# Altium project Boost-Shield.PrjPcb
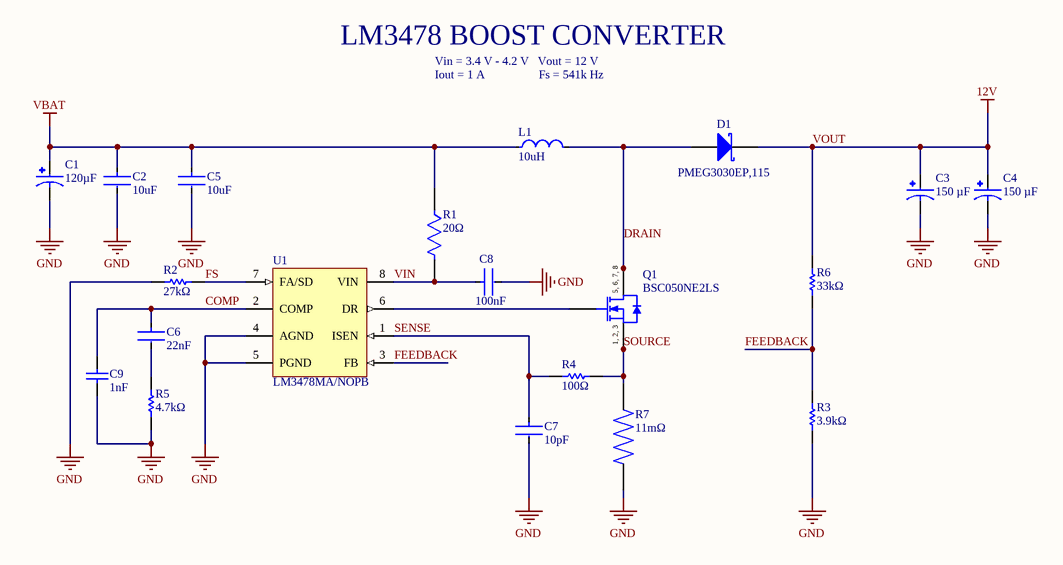
[diagram p0: Boost-Shield-V1.SchDoc]
Designer: Denil Poudel; Revision: 1
3 sheets, 74 parts. Net scope: global (net labels, ports and power ports of the same name join across sheets).
Board files: Boost-Shield-V1.PcbDoc, Boost-Shield-V2.PcbDoc, Boost-Shield-V1.5.PcbDoc
Sheets:
  Boost-Shield-V1.SchDoc
  Boost-Shield-V2.SchDoc
  Boost-Shield-V1.5.SchDoc

## Sheet Boost-Shield-V1.SchDoc
size A; SheetNumber: 1; SheetTotal: 3

### Parts
C1  120µF  [CAP_EEFCX0J121R]
C2  10uF  [FP-C0805C-DG-MFG]
C3  150 µF  [CAP_16TDC150MYF]
C4  150 µF  [CAP_16TDC150MYF]
C5  10uF  [FP-C0805C-DG-MFG]
C6  22nF  [FP-CGA4J-MFG]
C7  10pF  [FP-C0805C-DN-MFG]
C8  100nF  [FP-CC0805-0_85-MFG]
C9  1nF  [CAPC2013X140X50NL20T25]
D1  PMEG3030EP,115  [NXP-SOD128_V]
L1  10uH  [FP-IHLP-3232DZ-FP_2_413x5-MFG]
Q1  BSC050NE2LS  [INF-PG-TDSON-8-1_V]
R1  20Ω  [FP-CRCW0805-e3-IPC_C]
R2  27kΩ  [RESC2013X50X30ML20T20]
R3  3.9kΩ  [RESC2013X50X30LL20T20]
R4  100Ω  [RESC2013X50X30ML20T20]
R5  4.7kΩ  [RESC2013X70X40NL20T20]
R6  33kΩ  [RESC2013X50X30LL20T20]
R7  11mΩ  [RESC3115X65N]
U1  LM3478MA/NOPB  [D0008A_L]

### Nets
GND: C1.2 C2.2 C3.2 C4.2 C5.2 C7.2 C8.2 C9.1 R2.1 R3.1 R5.1 R7.1 U1.4(AGND) U1.5(PGND)
VBAT: C1.1 C2.1 C5.1 L1.1 R1.1
VOUT: C3.1 C4.1 D1.2(K) R6.2  [also labelled 12V]
COMP: C6.1 C9.2 U1.2(COMP)
DRAIN: D1.1(A) L1.2 Q1.5(DRAIN) Q1.6(DRAIN) Q1.7(DRAIN) Q1.8(DRAIN)
FEEDBACK: R3.2 R6.1 U1.3(FB)
FS: R2.2 U1.7(FA/SD)
SENSE: C7.1 R4.1 U1.1(ISEN)
SOURCE: Q1.1(SOURCE) Q1.2(SOURCE) Q1.3(SOURCE) R4.2 R7.2
VIN: C8.1 R1.2 U1.8(VIN)
NetC6_2: C6.2 R5.2
NetQ1_4: Q1.4(GATE) U1.6(DR)

### Notes on the sheet
- LM3478 BOOST CONVERTER
- Vin = 3.4 V - 4.2 V   Vout = 12 V
  Iout = 1 A                  Fs = 541k Hz
- (in symbol CMP-1090-00044-1) 5, 6, 7, 8; 1, 2, 3

### Library data of the parts
C1 = EEFCX0J121R: 120µF 6.3V Aluminum - Polymer Capacitors 2917 (7343 Metric) 15mOhm 2000 Hrs @ 105°C  EEFCX0J121R
C2 C5 = CMP-2007-03243-2: CAP CER 10UF 10V X5R 0805; Manufacturer Part Number: C0805C106K8PACTU; Manufacturer: Kemet; 3DS Part Number: 220-00001; Tolerance: 10%; Temperature Coefficient: 15%; Material: Ceramic; Device Class L2: Capacitors; Device Class L1: Passive Components; ComponentLink2URL: https://content.kemet.com/datasheets/KEM_C1006_X5R_SMD.pdf; Height: 1.4mm; Lead Free: Yes; Digikey Description: CAP CER 10UF 10V X5R 0805; Octopart: https://octopart.com/c0805c106k8pactu-kemet-98697; Capacitance: 10uF; Value: 10uF; Temperature Range Low: -55°C; Temperature: -55°C to +85°C; Automotive: No; Mouser Description: CAP CER 10UF 10V X5R 0805; Ipc Land Pattern Name: CAPC200125X125; Temperature Range High: +85°C; Voltage: 10V; RoHS: TRUE; Device Class L3: Ceramic Capacitors; ComponentLink2Description: Datasheet; Voltage Rating: 10V; Package: C0805C-DG; Temperature Characteristic: X5R; Category: Cap
C3 C4 = 16TDC150MYF: 150 µF Molded Tantalum Polymer Capacitor 16 V 2917 (7343 Metric) 50mOhm @ 100kHz
C6 = CMP-08246-000753-1: Cap Ceramic 22nF 50V C0G 5% Pad SMD 0805 +125°C Automotive T/R CGJ4J2C0G1H223J125AA; Capacitance: 22nF; Case/Package: 0805; Lead Free: Lead Free; Ratings: AEC-Q200; Case Code (Imperial): 0805; Height: 1.25mm; Length: 2mm; Weight: 0.000194oz; Tolerance: 5%; Dielectric: C0G; Voltage Rating: 50V; Max Operating Temperature: 125°C; Mount: Surface Mount; Case Code (Metric): 2012; REACH SVHC: No SVHC; Depth: 1.25mm; Width: 0.049inch; Package Quantity: 1; Voltage Rating (DC): 50V; Termination: SMD/SMT; Min Operating Temperature: -55°C; Thickness: 0.057inch; Packaging: Tape and Reel; Composition: Ceramic
C7 = CMP-1036-00838-4: CAP CER 10PF 16V 20% NP0 0805; Manufacturer Part Number: C0805C100M4GACTU; Manufacturer: KEMET; Material: Ceramic; Tolerance: 0.2; Temperature Characteristic: C0G; Temperature Coefficient: 30ppm/°C; Height: 0.88mm; Mouser Description: Multilayer Ceramic Capacitors MLCC - SMD/SMT 16volts 10pF C0G 20%; Device Class L2: Capacitors; Temperature Range Low: -55°C; ComponentLink2URL: https://content.kemet.com/datasheets/KEM_C1003_C0G_SMD.pdf; Category: Cap; Octopart: https://octopart.com/c0805c100m4gactu-kemet-16430157; Device Class L1: Passive Components; Capacitance: 10 pF; Temperature: -55°C to +125°C; RoHS: TRUE; Package: C0805C-DN; Device Class L3: Ceramic Capacitors; Automotive: No; Value: 10 pF; Voltage Rating: 16 V; Digikey Description: CAP CER 10PF 16V 20% NP0 0805; Temperature Range High: +125°C; Ipc Land Pattern Name: CAPC200125X78; Lead Free: Yes; ComponentLink2Description: Datasheet
C8 = CMP-1036-04402-6: CAP CER 0.1UF 16V X7R 0805; Manufacturer Part Number: CC0805KRX7R7BB104; Manufacturer: Yageo; Material: Ceramic; Tolerance: 0.1; Temperature: -30°C to +85°C; Lead Free: Yes; Footprint Url: http://www.yageo.com/exep/pages/download/literatures/UPY-C_GEN_24.pdf; Voltage Rating: 16 V; Package: CC0805-0.85; RoHS: TRUE; Digikey Description: CAP CER 0.1UF 16V X7R 0805; Category: Cap; Octopart: https://octopart.com/cc0805krx7r7bb104-yageo-39467769; Capacitance: 100 nF; Device Class L3: Ceramic Capacitors; ComponentLink2URL: http://www.yageo.com/documents/recent/UPY-GPHC_Y5V_6.3V-to-50V_8.pdf; Value: 100 nF; Temperature Range Low: -30°C; Mouser Description: Multilayer Ceramic Capacitors MLCC - SMD/SMT 100nF 16V X7R 10%; Automotive: No; Device Class L2: Capacitors; Height: 0.95mm; ComponentLink2Description: Datasheet; Temperature Characteristic: X7R; Ipc Land Pattern Name: CAPC200125X85; Device Class L1: Passive Components; Temperature Range High: +85°C
C9 = CMP-2007-04527-1: 08051A102JAT2A; Manufacturer: AVX Interconnect / Elco; Part Number: 08051A102JAT2A
D1 = CMP-2000-06906-1: Schottky Barrier Rectifier, 3 A, 30 V, -55 to 150 degC, 2-Pin SOD128, RoHS, Tape and Reel; Manufacturer: NXP Semiconductors; Other Names: 568-6761-6; Package Version: 02/2016; Capacitance @ Vr, F: 470pF@1V,1MHz; PCN Packaging: LighterReels02/Jan/2014; Speed: FastRecovery=200mA(Io); Current - Average Rectified (Io): 3A; Current - Reverse Leakage @ Vr: 5mA@30V; Voltage - DC Reverse (Vr) (Max): 30V; Online Catalog: SchottkyDiode; Voltage - Forward (Vf) (Max) @ If: 360mV@3A; Datasheet Version: Rev. 01, 12/2009; Mounting Type: SurfaceMount; Packaging: Digi-Reel®; Package URL: http://www.nxp.com/documents/outline_drawing/SOD128.pdf; Series: -; Package / Case: SOD-128; Supplier Device Package: SOD-128; Package Reference: SOD128; Manufacturer URL: http://www.nxp.com/; Operating Temperature - Junction: 150°C(Max); Family: Diodes,Rectifiers-Single; Standard Package: 1; Reverse Recovery Time (trr): -; Diode Type: Schottky; Mounting Technology: SurfaceMount; Category: DiscreteSemiconductorProducts; Package Description: 2-Pin Plastic Surface-Mounted Package, Body 2.5 x 3.8 mm; Datasheet URL: http://www.nxp.com/documents/data_sheet/PMEG3030EP.pdf
L1 = CMP-02424-000288-1: FIXED IND 10UH 5.2A 59.9 MOHM; DC Resistance (DCR): 59.9mR; Inductance Tolerance: 20%; Core Material: Metal; Test Frequency: 100kHz; Self Resonant Frequency: 15MHz; Shielding: Shielded; Saturation Current: 9A; Current Rating: 5.2A; Number of Pins: 2; Length: 8.64mm; Width: 0.322inch; Mount: Surface Mount; Termination: SMD/SMT; Radiation Hardening: No; Height: 4mm; Case/Package: 3232; Min Operating Temperature: -55°C; Military Standard: Not; Depth: 8.26mm; Lead Free: Lead Free; Max DC Current: 5.2A; Height - Seated (Max): 0.157inch; Packaging: Tape and Reel; Tolerance: 20%; Max Operating Temperature: 125°C; RMS Current (Irms): 5.2A; Package Quantity: 500; Inductance: 10uH
Q1 = CMP-1090-00044-1: N-Channel OptiMOS Power-MOSFET, 25 V VDS, 58 A ID, -55 to 150 degC, PG-TDSON-8-1, Reel, Green; Manufacturer: Infineon; RthJA (max): 50Â K/W; Polarity: N; RthJC (max): 4.5Â K/W; RDS (on) (max): 5Â mOhm; Ptot (max): 28Â W; RDS (on) (max) (@4.5V): 7.1Â mOhm; ID (max): 58Â A; VGS(th) (min): 1.2Â V; VDS (max): 25Â V; QG: 5Â nC; Green: TRUE; IDpuls (max): 232Â A; VGS(th) (max): 2Â V; ComponentLink3Description: Package Specification; ComponentLink2URL: http://www.infineon.com/dgdl/BSC050NE2LS_Rev+2.1_.pdf?folderId=db3a304326dfb1300126fb3bec803f1a&fileId=db3a304326dfb1300126fb5ce0cb3f2d; ComponentLink1Description: Manufacturer URL; Rth: 4.5Â K/W; ComponentLink3URL: http://www.infineon.com/cms/packages/SMD_-_Surface_Mounted_Devices/P-PG-TDSON/P-PG-TDSON-08-01x_2x_3.html?__locale=en; PackageReference: PG-TDSON-8-1; PartNumber: BSC050NE2LS; PackageDescription: 8-Pin Plastic (Green) Thin Dual Small Outline Non-Leaded Package, 5.15 x 5.9 mm Body, 1.27 mm Pitch; DatasheetVersion: Rev. 2.1; Packing: Reel; Mounting Technology: Surface Mount; ComponentLink1URL: http://www.infineon.com/; ComponentLink2Description: Datasheet; Halogen-free: TRUE
R1 = CMP-2001-03669-2: RES Thick Film, 20Ω, 1%, 0.125W, 100ppm/°C, 0805; Voltage Rating (DC): 150V; Power Rating: 125mW; Resistance: 20R; Case Code (Metric): 2012; Height: 0.02inch; Width: 0.049inch; Tolerance: 1%; Military Standard: Not; Case Code (Imperial): 0805; Case/Package: 0805; Min Operating Temperature: -55°C; Composition: Thick Film; Radiation Hardening: No; Depth: 1.25mm; Length: 2mm; Features: Automotive AEC-Q200; Max Power Dissipation: 125mW; Weight: 0.000194oz; Voltage Rating: 150V; Packaging: Tape and Reel; Temperature Coefficient: 100ppm/°C; Contact Plating: Tin; Package Quantity: 10; Max Operating Temperature: 155°C; Termination: Solder; Number of Terminations: 2; Lead Free: Lead Free
R2 = CMP-2001-03741-1: CRCW080527K0FKEA; Manufacturer: Vishay Dale; Part Number: CRCW080527K0FKEA
R3 = CMP-1013-00576-2: CRCW08053K90FKEA; Manufacturer: Vishay Dale; Part Number: CRCW08053K90FKEA
R4 = CMP-2001-04903-1: CRCW0805100RJNEA; Manufacturer: Vishay Dale; Part Number: CRCW0805100RJNEA
R5 = CMP-2001-00550-5: Chip Resistor, 4.7 KOhm, +/- 1%, 0.125 W, -55 to 155 degC, 0805 (2012 Metric), RoHS, Tape and Reel; Manufacturer: Panasonic; Voltage Rating: 150 V; Min Operating Temperature: -55 degC; PackageReference: 0805; Mounting Technology: Surface Mount; Height: 0.6 mm; PackageDescription: 2-Pin Surface Mount Device, Body 2 x 1.25 mm; RoHSCompliant: true; Length: 2 mm; REACH SVHC: Yes; Packaging: Tape and Reel; Pins: 2; Mount: Surface Mount; ComponentLink2Description: Datasheet; ComponentLink1URL: http://www.panasonic.com/; ComponentLink1Description: Manufacturer URL; DatasheetVersion: 04/2015; Package Quantity: 5000; ComponentLink2URL: http://industrial.panasonic.com/cdbs/www-data/pdf/RDA0000/AOA0000C86.pdf; Max Operating Temperature: 155 degC
R6 = CMP-2001-03828-1: CRCW080533K0JNEA; Manufacturer: Vishay Dale; Part Number: CRCW080533K0JNEA
R7 = RLP73V2BR011FTDF: 11 mOhms ±1% 0.5W, 1/2W Chip Resistor 1206 (3216 Metric) Current Sense Thick Film
U1 = CMP-0063-01437-3: High Efficiency Low-Side N-Channel Controller for Switching Regulator, 8-pin Narrow SOIC, 1000 Reel; Manufacturer: Texas Instruments; CompType: MiscPower; PackageTopMarking: NSZXTT*L3478*MA; High-Reliability: Y; PowerWise: N; ComponentLink1URL: http://www.ti.com/general/docs/lit/getliterature.tsp?genericPartNumber=LM3478&fileType=pdf; PinCount: 8; PartNumber: LM3478MA/NOPB; PackageDescription: SOIC Narrow, 4.9 x 3.9 x 1.45mm, 8 Lead, 1.27mm Pitch; PackageReference: D0008A; Code_IPC: SOIC127P600-8; RoHS: Y; Code_JEDEC: MS-012-AA; ComponentLink1Description: Datasheet URL

## Sheet Boost-Shield-V2.SchDoc
size A3; SheetNumber: 2; SheetTotal: 3
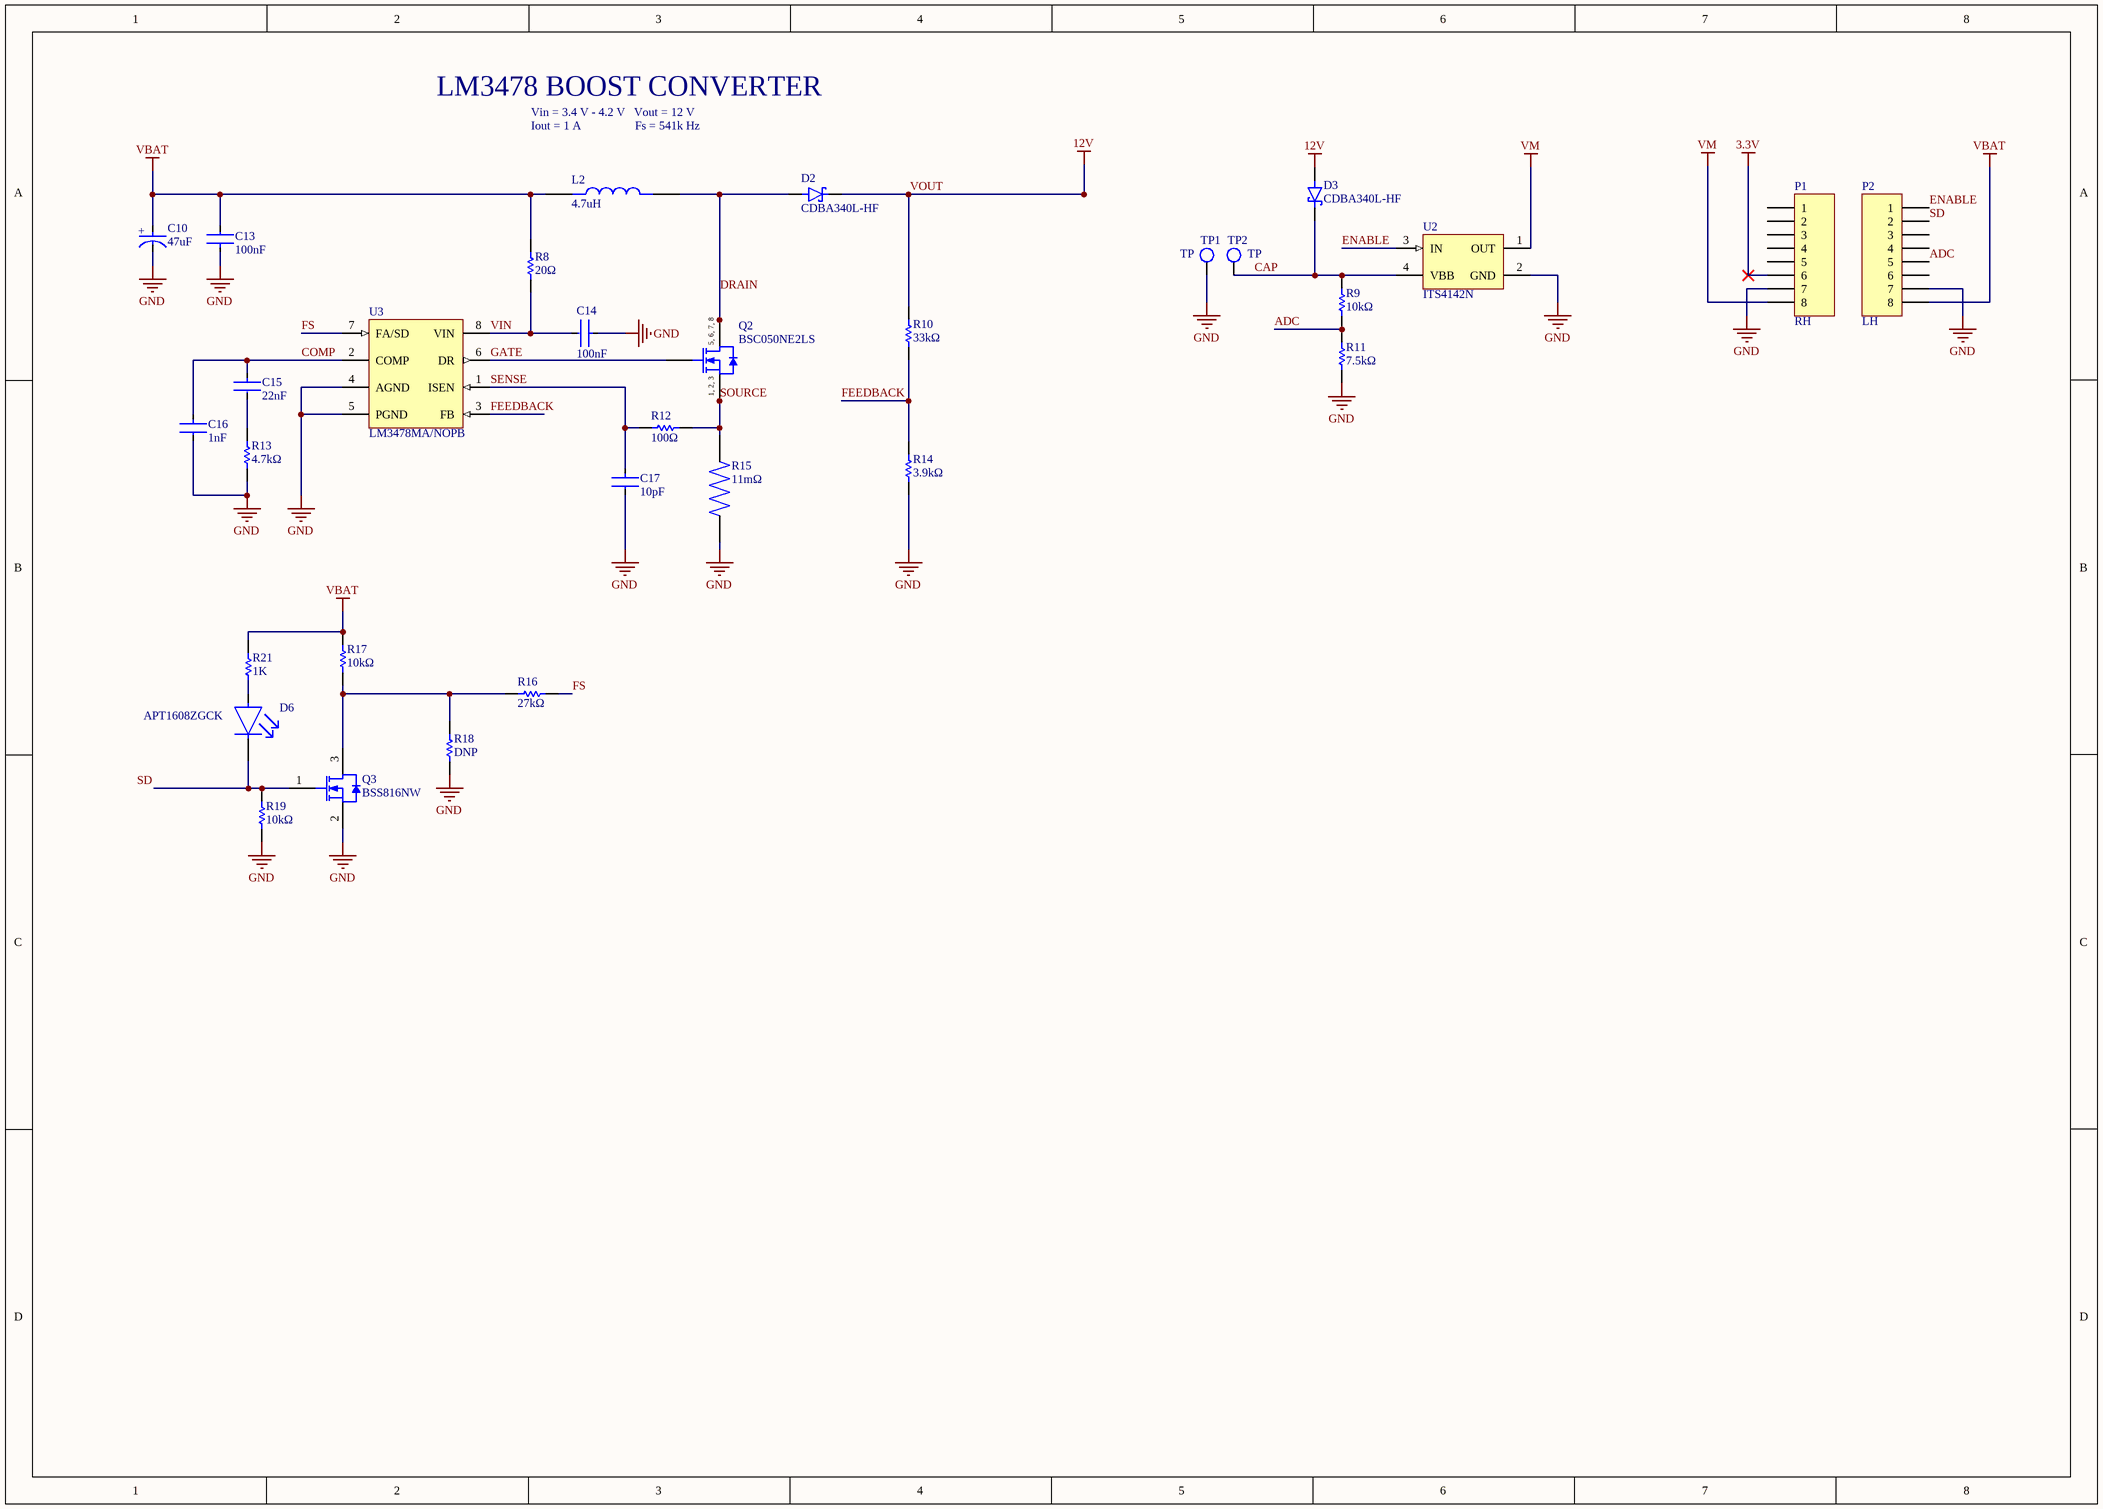
[diagram p1: Boost-Shield-V2.SchDoc]

### Parts
C10  47uF  [FP-F38M-MFG]
C13  100nF  [FP-CL10-IPC_C]
C14  100nF  [FP-CL10-IPC_C]
C15  22nF  [FP-CC0603-DA-MFG]
C16  1nF  [FP-0603-L_1_6_0_15-W_0_81-IPC_C]
C17  10pF  [FP-C0603C-CF-MFG]
D2  CDBA340L-HF  [DIOM5225X250N]
D3  CDBA340L-HF  [DIOM5225X250N]
D6  APT1608ZGCK  [FP-APT1608ZGCK-MFG]
L2  4.7uH  [IND_ETQP4M4R7KFN]
P1  RH  [HDR1X8]
P2  LH  [HDR1X8]
Q2  BSC050NE2LS  [INF-PG-TDSON-8-1_V]
Q3  BSS816NW  [INF-PG-SOT-323_M]
R8  20Ω  [RESC1608X55X30ML15T15]
R9  10kΩ  [RESC1609X55X30LL15T15]
R10  33kΩ  [RESC1609X50X30LL10T20]
R11  7.5kΩ  [RESC1609X50X30LL10T20]
R12  100Ω  [RESC1609X50X30ML8T20]
R13  4.7kΩ  [RESC1608X55X30NL15T15]
R14  3.9kΩ  [RESC1608X55X30LL15T15]
R15  11mΩ  [RESC3115X65N]
R16  27kΩ  [RESC1608X55X30ML15T15]
R17  10kΩ  [RESC1609X55X30LL15T15]
R18  DNP  [RESC1608X55X25ML10T15]
R19  10kΩ  [RESC1609X55X30LL15T15]
R21  1K  [RESC1608X55X25NL10T15]
TP1  TP  [TP]
TP2  TP  [TP]
U2  ITS4142N  [INF-SOT223_M]
U3  LM3478MA/NOPB  [D0008A_L]

### Nets
3.3V: P1.6
GND: C10.1(C) C13.1 C14.1 C16.2 C17.2 P1.7 P2.7 Q3.2(SOURCE) R11.1 R13.1 R14.1 R15.1 R18.1 R19.1 TP1.1 U2.2(GND) U3.4(AGND) U3.5(PGND)
VBAT: C10.2(A) C13.2 L2.1 P2.8 R8.2 R17.2 R21.2
VM: P1.8 U2.1(OUT)
VOUT: D2.C(K) D3.A R10.2  [also labelled 12V]
ADC: P2.5 R9.1 R11.2
CAP: D3.C(K) R9.2 TP2.1 U2.4(VBB)
COMP: C15.1 C16.1 U3.2(COMP)
DRAIN: D2.A L2.2 Q2.5(DRAIN) Q2.6(DRAIN) Q2.7(DRAIN) Q2.8(DRAIN)
ENABLE: P2.1 U2.3(IN)
FEEDBACK: R10.1 R14.2 U3.3(FB)
FS: R16.2 U3.7(FA/SD)
GATE: Q2.4(GATE) U3.6(DR)
SD: D6.1(C) P2.2 Q3.1(GATE) R19.2
SENSE: C17.1 R12.1 U3.1(ISEN)
SOURCE: Q2.1(SOURCE) Q2.2(SOURCE) Q2.3(SOURCE) R12.2 R15.2
VIN: C14.2 R8.1 U3.8(VIN)
NetC15_2: C15.2 R13.2
NetD6_2: D6.2(A) R21.1
NetQ3_3: Q3.3(DRAIN) R16.1 R17.1 R18.2

Not connected (* = marked no-connect by the designer): P1 1 2 3 4 5; P2 3 4 6

### Notes on the sheet
- LM3478 BOOST CONVERTER
- Vin = 3.4 V - 4.2 V   Vout = 12 V
  Iout = 1 A                  Fs = 541k Hz
- (in symbol CMP-1090-00044-1) 5, 6, 7, 8; 1, 2, 3
- (in symbol CMP-04423-000016-1) +

### Library data of the parts
C10 = CMP-04423-000016-1: CAP TANT POLY 47UF 6.3V SMD / F380J476MMAAXEH3; Manufacturer: AVX; Dissipation Factor: 10%; Ripple Current: 289mA; Life: 1000Hours; Leakage Current: 59.2uA; Esr: 300mΩ; Material: Tantalum-Polymer; Tolerance: 20%; ComponentLink2Description: Datasheet; Device Class L2: Capacitors; Temperature Range Low: -55°C; Device Class L1: Passive Components; Voltage Rating: 6.3V; Device Class L3: Polymer Capacitors; Automotive: No; Temperature: -55°C to +105°C; Lead Free: Yes; Height: 1mm; Digikey Description: CAP TANT POLY 47UF 6.3V SMD; ComponentLink2URL: http://datasheets.avx.com/F38.pdf; Package: F38M; RoHS: TRUE; Capacitance: 47uF; Octopart: https://octopart.com/f380j476mmaaxeh3-avx-67040374; Manufacturer Part Number: F380J476MMAAXEH3; Value: 47uF; Footprint Url: http://www.avx.com/download/software/literature/AVX-Footprint-Library.pdf; Temperature Range High: +105°C; Category: Cap
C13 C14 = CMP-13271-001724-1: Cap Ceramic 100nF 50V X7R ±20% Pad SMD 0603 +125°C T/R / CL10B104MB8NNNC; Mount: Surface Mount; Lead Free: Lead Free; Max Operating Temperature: 125°C; Voltage Rating: 50V; Case Code (Imperial): 0603; Capacitance: 100nF; Height: 0.8mm; Length: 1.6mm; Tolerance: 20%; Case Code (Metric): 1608; Thickness: 0.035inch; Depth: 0.8mm; Width: 0.031inch; Package Quantity: 1; Min Operating Temperature: -55°C; Case/Package: 0603; Radiation Hardening: No; Voltage Rating (DC): 50V; Dielectric: X7R; Packaging: Tape and Reel
C15 = CMP-2100-03602-2: 0603 22 nF 50 V ±10 % Tolerance X7R SMT Multilayer Ceramic Capacitor / CC0603KRX7R9BB223; Manufacturer: YAGEO; Temperature Coefficient: 15%; Tolerance: 0.1; Voltage Rating: 50 V; Device Class L3: Ceramic Capacitors; Temperature Range Low: -55°C; RoHS: TRUE; Temperature Range High: +125°C; Category: Cap; Capacitance: 22 nF; Height: 0.9mm; Manufacturer Part Number: CC0603KRX7R9BB223; ComponentLink2Description: Datasheet; Value: 22 nF; ComponentLink2URL: http://www.yageo.com/documents/recent/UPY-GPHC_X7R_6.3V-to-50V_18.pdf; Material: Ceramic; Digikey Description: 0603 22 nF 50 V ±10 % Tolerance X7R SMT Multilayer Ceramic Capacitor; Device Class L1: Passive Components; Device Class L2: Capacitors; Temperature Characteristic: X7R; Octopart: https://octopart.com/cc0603krx7r9bb223-yageo-41224721; Automotive: No; Temperature: -55°C to +125°C; Lead Free: Yes; Package: CC0603-DA; Mouser Description: Multilayer Ceramic Capacitors MLCC - SMD/SMT 22nF 50V X7R 10%; Footprint Url: http://www.yageo.com/exep/pages/download/literatures/UPY-C_GEN_24.pdf; Voltage: 50 V
C16 = CMP-2006-02076-2: CAP CER 10000PF 50V X7R 0603 / 06035C103KAT4A; Insulation Resistance: 100GR; Tolerance: 10%; Dissipation Factor: 2.5%; Capacitance: 10nF; Number of Pins: 2; Package Quantity: 15000; Voltage Rating (DC): 50V; Case Code (Imperial): 0603; Series: -; Depth: 0.81mm; Termination: SMD/SMT; Packaging: Tape and Reel; Length: 1.6mm; Radiation Hardening: No; REACH SVHC: No SVHC; Height: 0.9mm; Min Operating Temperature: -55°C; Voltage Rating: 50V; RoHS Compliant: Yes; Case Code (Metric): 1608; Width: 0.81mm; Lead Free: Lead Free; Construction: Flat; Case/Package: 0603; Voltage: 50V; Dielectric: X7R; Max Operating Temperature: 125°C; Mount: Surface Mount
C17 = CMP-2006-03324-2: CAP CER 10PF 100V 5% NP0 0603 / C0603C100J1GACTU; Manufacturer: KEMET; Temperature Coefficient: 30ppm/°C; Automotive Grade: Grade 1; Material: Ceramic; Tolerance: 0.05; Temperature Characteristic: C0G; Temperature: -55°C to +125°C; Manufacturer Part Number: C0603C100J1GACTU; Voltage Rating: 100 V; ComponentLink2Description: Datasheet; Octopart: https://octopart.com/c0603c100j1gactu-kemet-109684; Mouser Description: Multilayer Ceramic Capacitors MLCC - SMD/SMT 100volts 10pF C0G 5%; Automotive: Yes; Digikey Description: CAP CER 10PF 100V 5% NP0 0603; Device Class L2: Capacitors; Lead Free: Yes; Height: 0.87mm; ComponentLink2URL: https://api.kemet.com/component-edge/download/datasheet/C0603C100J5GACAUTO.pdf; Value: 10 pF; Temperature Range High: +125°C; Package: C0603C-CF; Temperature Range Low: -55°C; RoHS: TRUE; Device Class L1: Passive Components; Category: Cap; Capacitance: 10 pF; Device Class L3: Ceramic Capacitors
D2 D3 = CDBA340L-HF: DIODE SCHOTTKY 40V 3A DO214AC; Manufacturer: Comchip; Supplier 1: Digi-Key; Manufacturer Part Number: CDBA340L-HF; RoHS: Yes; Category: Rectifier Diodes; Stock 1: 46445; Pricing 1: 1=0.60000, 10=0.53100, 100=0.40730, 500=0.32200, 1000=0.25760, 2000=0.23345 (USD); Mount: Surface Mount; Package Quantity: 5000; Packaging: Cut Tape; Average Rectified Current: 3A; Max Reverse Voltage (DC): 40V; Series: -; RoHS Compliant: Yes; ComponentLink1URL: https://datasheet.ciiva.com/6377/cdba340l-hfrevc514368-6377916.pdf?src-supplier=Digi-Key; ComponentLink1Description: https://datasheet.ciiva.com/6377/cdba340l-hfrevc514368-6377916.pdf?src-supplier=Digi-Key; Supplier Part Number 1: 641-1702-1-ND
D6 = CMP-44529-000024-1: LED GREEN CLEAR CHIP SMD; Forward Voltage: 3.3V; Dominant Wavelength: 525nm; Forward Current: 20mA; Lens Color: Colorless; Viewing Angle: 120°; Luminous Intensity: 350mcd; Lens Transparency: Clear; Color: Green; Max Operating Temperature: 85°C; Case/Package: 0603; Mount: Surface Mount; Min Operating Temperature: -40°C; Case Code (Metric): 1608; Test Current: 20mA; Packaging: Tape and Reel; Width: 0.8mm; Package Quantity: 1; Height: 0.75mm; Length: 1.6mm; Illumination Color: Green; Lead Free: Lead Free; Case Code (Imperial): 0603
L2 = ETQ-P4M4R7KFN: Fixed Ind 4.7UH 7.3A 22.77MOHM; Manufacturer: Panasonic; Supplier 1: Digi-Key; Manufacturer Part Number: ETQ-P4M4R7KFN; RoHS: No; Category: Fixed Inductors; Stock 1: 1000; Pricing 1: 1=1.10000, 10=1.02600, 25=0.94720, 50=0.78920, 100=0.74190, 250=0.66296 (USD); Supplier Part Number 1: P124174CT-ND
P1 P2 = Header 8: Header, 8-Pin; LatestRevisionDate: 17-Jul-2002; LatestRevisionNote: Re-released for DXP Platform.; Publisher: Altium Limited
Q2 = CMP-1090-00044-1: as Q1 on sheet Boost-Shield-V1; ComponentLink3Description: Package Specification; ComponentLink2URL: http://www.infineon.com/dgdl/BSC050NE2LS_Rev+2.1_.pdf?folderId=db3a304326dfb1300126fb3bec803f1a&fileId=db3a304326dfb1300126fb5ce0cb3f2d; ComponentLink1Description: Manufacturer URL; Rth: 4.5Â K/W; ComponentLink3URL: http://www.infineon.com/cms/packages/SMD_-_Surface_Mounted_Devices/P-PG-TDSON/P-PG-TDSON-08-01x_2x_3.html?__locale=en; PackageReference: PG-TDSON-8-1; PartNumber: BSC050NE2LS; PackageDescription: 8-Pin Plastic (Green) Thin Dual Small Outline Non-Leaded Package, 5.15 x 5.9 mm Body, 1.27 mm Pitch; DatasheetVersion: Rev. 2.1; Packing: Reel; Mounting Technology: Surface Mount; ComponentLink1URL: http://www.infineon.com/; ComponentLink2Description: Datasheet; Halogen-free: TRUE
Q3 = CMP-1149-00038-1: N-Channel OptiMOS 2 Small-Signal-Transistor, 20 V VDS, 1.4 A ID, -55 to 150 degC, PG-SOT-323, Reel, Green; Manufacturer: Infineon; QG: 0.6Â nC; VGS(th) (min): 0.3Â V; ID (max): 1.4Â A; Ptot (max): 0.5Â W; VDS (max): 20 V; RthJA (max): 250 K/W; Green: TRUE; RDS (on) (max) (@1.8V): 240 mOhm; RDS (on) (max): 160 mOhm; IDpuls (max): 5.6Â A; VGS(th) (max): 0.75Â V; ComponentLink2URL: http://www.infineon.com/dgdl/BSS816NW_Rev2.3_.pdf?folderId=db3a3043156fd573011622e10b5c1f67&fileId=db3a304335113a6301351e704a2e1332; PackageVersion: Apr-08; Halogen-free: TRUE; DatasheetVersion: Rev. 2.3; ComponentLink3URL: http://www.infineon.com/dgdl/SOT323-Package_Overview.pdf?folderId=db3a30431936bc4b0119533e1dcb3c92&fileId=db3a30431936bc4b011953495f283cb1; PartNumber: BSS816NW; ComponentLink2Description: Datasheet; ComponentLink1Description: Manufacturer URL; Mounting Technology: Surface Mount; ComponentLink1URL: http://www.infineon.com/; ComponentLink3Description: Package Specification; PackageDescription: 3-Pin Small Outline Transistor Package, 2 x 1.25 mm Body, 0.65 mm Pitch; Packing: Reel; RDS (on) (max) (@2.5V): 160 mOhm; PackageReference: PG-SOT-323
R8 = CMP-2000-00739-1: ERJ-3GEYJ200V; Manufacturer: Panasonic; Part Number: ERJ-3GEYJ200V
R9 R17 R19 = CMP-1012-00623-3: Chip Resistor, 10 KOhm, +/- 1%, 0.1 W, -55 to 155 degC, 0603 (1608 Metric), RoHS, Tape and Reel / ERJ3EKF1002V; Manufacturer: Panasonic; Voltage Rating: 75V; Case\/Package: 0603; Power Rating: 100mW; Resistance: 10KOhm; Temperature Coefficient: 100ppm\/degreesC; Number of Pins: 2; Package Reference: 603; Depth: 0.8mm; Mount: SurfaceMount; Package Description: 2-Pin Surface Mount Device, Body 1.6 x 0.85 mm; Datasheet Version: 02/2017; Length: 1.6mm; Lead Free: LeadFree; Height: 0.45mm; Number of Terminations: 2; Max Power Dissipation: 100mW; Min Operating Temperature: -55degC; Datasheet URL: https://industrial.panasonic.com/cdbs/www-data/pdf/RDA0000/AOA0000C304.pdf; Termination: SMD/SMT; Case Code (Metric): 1608; Case Code (Imperial): 0603; Tolerance: 1%; Max Operating Temperature: 155degC; RoHSCompliant: true; Voltage Rating (DC): 75V; Radiation Hardening: No; Packaging: TapeandReel; Composition: ThickFilm; Mounting Technology: SurfaceMount; Manufacturer URL: http://www.panasonic.com/; Width: 0.031inch; REACH SVHC: NoSVHC; Contact Plating: Tin; Military Standard: Not; Package Quantity: 1
R10 = CMP-2000-03246-1: CRCW060333K0JNEA; Manufacturer: Vishay Dale; Part Number: CRCW060333K0JNEA
R11 = CMP-2000-03583-1: CRCW06037K50FKEA; Manufacturer: Vishay Dale; Part Number: CRCW06037K50FKEA
R12 = CMP-2000-03824-5: Chip Resistor, 100 Ohm, +/- 1%, 100 mW,-55 to 155 degC, 0603 (1608 Metric), RoHS, Tape and Ree / CRCW0603100RFKEA; Manufacturer: Vishay Semiconductor; ComponentLink2URL: http://www.vishay.com/docs/20035/dcrcwe3.pdf; ComponentLink1URL: http://www.vishay.com/; Mounting Technology: Surface Mount; ComponentLink1Description: Manufacturer URL; ComponentLink2Description: Datasheet; PackageDescription: 2-Pin Surface Mount Device, Body 1.575 x 0.85 mm; PackageReference: 0603; DatasheetVersion: 06/2012
R13 = CMP-1012-00586-3: Precision Thick Film Chip Resistor, 4.7 KOhm, +/- 1%, -55 to 155 degC, 0603 (1608 Metric), RoHS, Tape and Reel / ERJ-3EKF4701V; Resistance: 220 Ohm; Voltage Rating: 50 V; Elements: 4; Case\Package: 1205; Tolerance: 5%; Power Rating: 250 mW; PackageReference: 0603; Max Operating Temperature: 125 degC; REACH SVHC: No SVHC; Width: 0.063 inch; Length: 0.126 inch; Height: 0.024 inch; Mount: Surface Mount; Package Quantity: 1; DatasheetVersion: Apr-15; ComponentLink1Description: Manufacturer URL; Min Operating Temperature: -55 degC; Packaging: Tape and Reel; Radiation Hardening: No; ComponentLink2URL: http://industrial.panasonic.com/cdbs/www-data/pdf/RDA0000/AOA0000C86.pdf; Case Code (Metric): 3216; Pins: 8; Case Code (Imperial): 1206; Type (Resistor): Thick Film; RoHSCompliant: true; ComponentLink2Description: Datasheet; PackageDescription: 2-Pin Surface Mount Device, Body 1.6 x 0.85 mm; ComponentLink1URL: http://www.panasonic.com/
R14 = CMP-2000-00783-1: ERJ-3GEYJ392V; Manufacturer: Panasonic; Part Number: ERJ-3GEYJ392V
R15 = RLP73V2BR011FTDF: as R7 on sheet Boost-Shield-V1
R16 = CMP-2000-00390-1: ERJ3EKF2702V; Manufacturer: Panasonic; Part Number: ERJ3EKF2702V
R18 = CMP-2100-03667-1: Chip Resistor, 0 Ohm, +/- 5%, 0.1 W, -55 to 155 degC, 0603 (1608 Metric), RoHS, Tape and Reel / RC0603JR-070RL; Manufacturer: Yageo; Temperature Coefficient: 200ppm/degreesC; Voltage Rating: 50V; Power Rating: 100mW; Resistance: 0mOhm; Width: 0.8mm; Max Operating Temperature: 155degC; Tolerance: 5%; Package Reference: 0603; Height: 0.45mm; Depth: 0.8mm; Package Description: 2-Pin Surface Mount Device, Body 1.6 x 0.8 mm; Termination: SMD/SMT; Package Quantity: 5000; Case/Package: 0603; Case Code (Imperial): 0603; Radiation Hardening: No; Number of Pins: 2; Length: 1.6mm; Lead Free: LeadFree; Voltage Rating (DC): 50V; Military Standard: Not; Datasheet URL: http://www.yageo.com/NewPortal/yageodocoutput?fileName=/pdf/R-Chip/PYu-RC_Group_51_RoHS_L_5.pdf; Manufacturer URL: http://www.yageo.com/; Packaging: TapeandReel; Case Code (Metric): 1608; Min Operating Temperature: -55degC; Composition: ThickFilm; RoHSCompliant: true; Contact Plating: Tin; Datasheet Version: Rev. 5, 10/2016; REACH SVHC: NoSVHC
R21 = CMP-1659-00009-4: Chip Resistor, 1 KOhm, +/-1%, 0.1 W, -55 to 155 degC, 0603 (1608 Metric), RoHS, Tape and Reel; Manufacturer: Yageo; Voltage Rating: 50 V; ComponentLink2URL: http://www.yageo.com/documents/recent/PYu-RC_Group_51_RoHS_L_04.pdf; Max Operating Temperature: 155 degC; PackageDescription: 2-Pin Surface Mount Device, Body 1.6 x 0.8 mm; Packaging: Tape and Reel; ComponentLink3Description: Package Specification; REACH SVHC: No SVHC; Mount: Surface Mount; ComponentLink2Description: Datasheet; Length: 1.6 mm; PackageReference: 0603; Height: 0.45 mm; DatasheetVersion: Rev. 4, 02/2016; Min Operating Temperature: -55 degC; ComponentLink1Description: Manufacturer URL; Package Quantity: 200; RoHSCompliant: true; ComponentLink3URL: http://www.farnell.com/datasheets/443971.pdf; Pins: 2; Mounting Technology: Surface Mount; ComponentLink1URL: http://www.yageo.com/
U2 = CMP-1095-00140-1: Smart High-Side Power Switch for Industrial Applications 1 Channel: 1 x 200 mOhm, 12 to 45 V Operating, -30 to 85 degC, SOT223, Reel, Green; Manufacturer: Infineon; IL (nom)min - all channels active: 1.4Â A; RON @ 25 degC: 200 mOhm (max); RON (max) @ Tj max: 320 mOhm; Operating Voltage Range (max): 45 V; IL (SCp): 4.5Â A; toff (max): 150 us; Green: TRUE; IL (SC): 3 A; Operating Voltage Range (min): 12 V; Ptot (max): 1.4Â W; Channels: 1; ton (max): 100 us; PackageDescription: 4-Pin Small Outline Transistor Package, 6.5 x 3.5 mm Body, 2.3 mm Pitch; PartNumber: ITS4142N; ComponentLink2Description: Datasheet; PackageReference: SOT223; Mounting Technology: Surface Mount; PackageVersion: Apr-08; Packing: Reel; ComponentLink1Description: Manufacturer URL; Load Current (typ): 1.4Â A; ComponentLink3Description: Package Specification; ComponentLink1URL: http://www.infineon.com/; IL (nom)min - one channel active: 1.4Â A; ComponentLink3URL: http://www.infineon.com/dgdl/SOT223-Package_Overview.pdf?folderId=db3a30431936bc4b0119530470b03c3d&fileId=db3a30431936bc4b0119531d40b93c5c; ComponentLink2URL: http://www.infineon.com/dgdl/ITS4142N_20060309.pdf?folderId=db3a304412b407950112b408e8c90004&fileId=db3a304412b407950112b4296b0840e1
U3 = CMP-0063-01437-3: as U1 on sheet Boost-Shield-V1; ComponentLink1URL: http://www.ti.com/general/docs/lit/getliterature.tsp?genericPartNumber=LM3478&fileType=pdf; PinCount: 8; PartNumber: LM3478MA/NOPB; PackageDescription: SOIC Narrow, 4.9 x 3.9 x 1.45mm, 8 Lead, 1.27mm Pitch; PackageReference: D0008A; Code_IPC: SOIC127P600-8; RoHS: Y; Code_JEDEC: MS-012-AA; ComponentLink1Description: Datasheet URL

## Sheet Boost-Shield-V1.5.SchDoc
size B; SheetNumber: 3; SheetTotal: 3
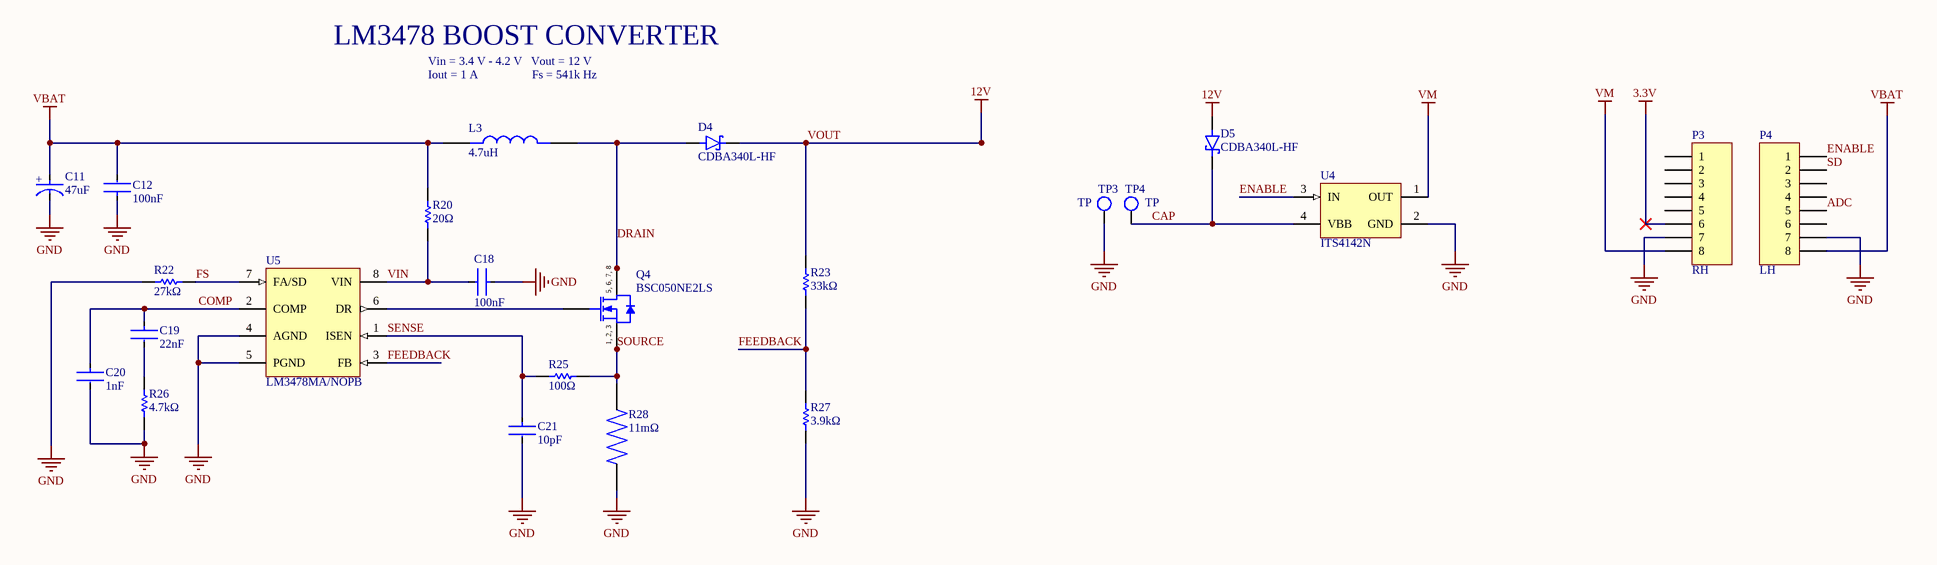
[diagram p2: Boost-Shield-V1.5.SchDoc]

### Parts
C11  47uF  [FP-F38M-MFG]
C12  100nF  [FP-CL10-IPC_C]
C18  100nF  [FP-CL10-IPC_C]
C19  22nF  [FP-CC0603-DA-MFG]
C20  1nF  [FP-0603-L_1_6_0_15-W_0_81-IPC_C]
C21  10pF  [FP-C0603C-CF-MFG]
D4  CDBA340L-HF  [DIOM5225X250N]
D5  CDBA340L-HF  [DIOM5225X250N]
L3  4.7uH  [IND_ETQP4M4R7KFN]
P3  RH  [HDR1X8]
P4  LH  [HDR1X8]
Q4  BSC050NE2LS  [INF-PG-TDSON-8-1_V]
R20  20Ω  [RESC1608X55X30ML15T15]
R22  27kΩ  [RESC1608X55X30ML15T15]
R23  33kΩ  [RESC1609X50X30LL10T20]
R25  100Ω  [RESC1609X50X30ML8T20]
R26  4.7kΩ  [RESC1608X55X30NL15T15]
R27  3.9kΩ  [RESC1608X55X30LL15T15]
R28  11mΩ  [RESC3115X65N]
TP3  TP  [TP]
TP4  TP  [TP]
U4  ITS4142N  [INF-SOT223_M]
U5  LM3478MA/NOPB  [D0008A_L]

### Nets
3.3V: P3.6
GND: C11.1(C) C12.1 C18.1 C20.2 C21.2 P3.7 P4.7 R22.1 R26.1 R27.1 R28.1 TP3.1 U4.2(GND) U5.4(AGND) U5.5(PGND)
VBAT: C11.2(A) C12.2 L3.1 P4.8 R20.2
VM: P3.8 U4.1(OUT)
VOUT: D4.C(K) D5.A R23.2  [also labelled 12V]
ADC: P4.5
CAP: D5.C(K) TP4.1 U4.4(VBB)
COMP: C19.1 C20.1 U5.2(COMP)
DRAIN: D4.A L3.2 Q4.5(DRAIN) Q4.6(DRAIN) Q4.7(DRAIN) Q4.8(DRAIN)
ENABLE: P4.1 U4.3(IN)
FEEDBACK: R23.1 R27.2 U5.3(FB)
FS: R22.2 U5.7(FA/SD)
SD: P4.2
SENSE: C21.1 R25.1 U5.1(ISEN)
SOURCE: Q4.1(SOURCE) Q4.2(SOURCE) Q4.3(SOURCE) R25.2 R28.2
VIN: C18.2 R20.1 U5.8(VIN)
NetC19_2: C19.2 R26.2
NetQ4_4: Q4.4(GATE) U5.6(DR)

Not connected (* = marked no-connect by the designer): P3 1 2 3 4 5; P4 3 4 6

### Notes on the sheet
- LM3478 BOOST CONVERTER
- Vin = 3.4 V - 4.2 V   Vout = 12 V
  Iout = 1 A                  Fs = 541k Hz
- (in symbol CMP-1090-00044-1) 5, 6, 7, 8; 1, 2, 3
- (in symbol CMP-04423-000016-1) +

### Library data of the parts
C11 = CMP-04423-000016-1: as C10 on sheet Boost-Shield-V2; ComponentLink2Description: Datasheet; Device Class L2: Capacitors; Temperature Range Low: -55°C; Device Class L1: Passive Components; Voltage Rating: 6.3V; Device Class L3: Polymer Capacitors; Automotive: No; Temperature: -55°C to +105°C; Lead Free: Yes; Height: 1mm; Digikey Description: CAP TANT POLY 47UF 6.3V SMD; ComponentLink2URL: http://datasheets.avx.com/F38.pdf; Package: F38M; RoHS: TRUE; Capacitance: 47uF; Octopart: https://octopart.com/f380j476mmaaxeh3-avx-67040374; Manufacturer Part Number: F380J476MMAAXEH3; Value: 47uF; Footprint Url: http://www.avx.com/download/software/literature/AVX-Footprint-Library.pdf; Temperature Range High: +105°C; Category: Cap
C12 C18 = CMP-13271-001724-1: as C13 on sheet Boost-Shield-V2; Mount: Surface Mount; Lead Free: Lead Free; Max Operating Temperature: 125°C; Voltage Rating: 50V; Case Code (Imperial): 0603; Capacitance: 100nF; Height: 0.8mm; Length: 1.6mm; Tolerance: 20%; Case Code (Metric): 1608; Thickness: 0.035inch; Depth: 0.8mm; Width: 0.031inch; Package Quantity: 1; Min Operating Temperature: -55°C; Case/Package: 0603; Radiation Hardening: No; Voltage Rating (DC): 50V; Dielectric: X7R; Packaging: Tape and Reel
C19 = CMP-2100-03602-2: as C15 on sheet Boost-Shield-V2; Device Class L3: Ceramic Capacitors; Temperature Range Low: -55°C; RoHS: TRUE; Temperature Range High: +125°C; Category: Cap; Capacitance: 22 nF; Height: 0.9mm; Manufacturer Part Number: CC0603KRX7R9BB223; ComponentLink2Description: Datasheet; Value: 22 nF; ComponentLink2URL: http://www.yageo.com/documents/recent/UPY-GPHC_X7R_6.3V-to-50V_18.pdf; Material: Ceramic; Digikey Description: 0603 22 nF 50 V ±10 % Tolerance X7R SMT Multilayer Ceramic Capacitor; Device Class L1: Passive Components; Device Class L2: Capacitors; Temperature Characteristic: X7R; Octopart: https://octopart.com/cc0603krx7r9bb223-yageo-41224721; Automotive: No; Temperature: -55°C to +125°C; Lead Free: Yes; Package: CC0603-DA; Mouser Description: Multilayer Ceramic Capacitors MLCC - SMD/SMT 22nF 50V X7R 10%; Footprint Url: http://www.yageo.com/exep/pages/download/literatures/UPY-C_GEN_24.pdf; Voltage: 50 V
C20 = CMP-2006-02076-2: as C16 on sheet Boost-Shield-V2; Number of Pins: 2; Package Quantity: 15000; Voltage Rating (DC): 50V; Case Code (Imperial): 0603; Series: -; Depth: 0.81mm; Termination: SMD/SMT; Packaging: Tape and Reel; Length: 1.6mm; Radiation Hardening: No; REACH SVHC: No SVHC; Height: 0.9mm; Min Operating Temperature: -55°C; Voltage Rating: 50V; RoHS Compliant: Yes; Case Code (Metric): 1608; Width: 0.81mm; Lead Free: Lead Free; Construction: Flat; Case/Package: 0603; Voltage: 50V; Dielectric: X7R; Max Operating Temperature: 125°C; Mount: Surface Mount
C21 = CMP-2006-03324-2: as C17 on sheet Boost-Shield-V2; Temperature: -55°C to +125°C; Manufacturer Part Number: C0603C100J1GACTU; Voltage Rating: 100 V; ComponentLink2Description: Datasheet; Octopart: https://octopart.com/c0603c100j1gactu-kemet-109684; Mouser Description: Multilayer Ceramic Capacitors MLCC - SMD/SMT 100volts 10pF C0G 5%; Automotive: Yes; Digikey Description: CAP CER 10PF 100V 5% NP0 0603; Device Class L2: Capacitors; Lead Free: Yes; Height: 0.87mm; ComponentLink2URL: https://api.kemet.com/component-edge/download/datasheet/C0603C100J5GACAUTO.pdf; Value: 10 pF; Temperature Range High: +125°C; Package: C0603C-CF; Temperature Range Low: -55°C; RoHS: TRUE; Device Class L1: Passive Components; Category: Cap; Capacitance: 10 pF; Device Class L3: Ceramic Capacitors
D4 D5 = CDBA340L-HF: as D2 on sheet Boost-Shield-V2; Supplier 1: Digi-Key; Manufacturer Part Number: CDBA340L-HF; RoHS: Yes; Category: Rectifier Diodes; Stock 1: 46445; Pricing 1: 1=0.60000, 10=0.53100, 100=0.40730, 500=0.32200, 1000=0.25760, 2000=0.23345 (USD); Mount: Surface Mount; Package Quantity: 5000; Packaging: Cut Tape; Average Rectified Current: 3A; Max Reverse Voltage (DC): 40V; Series: -; RoHS Compliant: Yes; ComponentLink1URL: https://datasheet.ciiva.com/6377/cdba340l-hfrevc514368-6377916.pdf?src-supplier=Digi-Key; ComponentLink1Description: https://datasheet.ciiva.com/6377/cdba340l-hfrevc514368-6377916.pdf?src-supplier=Digi-Key; Supplier Part Number 1: 641-1702-1-ND
L3 = ETQ-P4M4R7KFN: as L2 on sheet Boost-Shield-V2; Supplier 1: Digi-Key; Manufacturer Part Number: ETQ-P4M4R7KFN; RoHS: No; Category: Fixed Inductors; Stock 1: 1000; Pricing 1: 1=1.10000, 10=1.02600, 25=0.94720, 50=0.78920, 100=0.74190, 250=0.66296 (USD); Supplier Part Number 1: P124174CT-ND
P3 P4 = Header 8: Header, 8-Pin; LatestRevisionDate: 17-Jul-2002; LatestRevisionNote: Re-released for DXP Platform.; Publisher: Altium Limited
Q4 = CMP-1090-00044-1: as Q1 on sheet Boost-Shield-V1; ComponentLink3Description: Package Specification; ComponentLink2URL: http://www.infineon.com/dgdl/BSC050NE2LS_Rev+2.1_.pdf?folderId=db3a304326dfb1300126fb3bec803f1a&fileId=db3a304326dfb1300126fb5ce0cb3f2d; ComponentLink1Description: Manufacturer URL; Rth: 4.5Â K/W; ComponentLink3URL: http://www.infineon.com/cms/packages/SMD_-_Surface_Mounted_Devices/P-PG-TDSON/P-PG-TDSON-08-01x_2x_3.html?__locale=en; PackageReference: PG-TDSON-8-1; PartNumber: BSC050NE2LS; PackageDescription: 8-Pin Plastic (Green) Thin Dual Small Outline Non-Leaded Package, 5.15 x 5.9 mm Body, 1.27 mm Pitch; DatasheetVersion: Rev. 2.1; Packing: Reel; Mounting Technology: Surface Mount; ComponentLink1URL: http://www.infineon.com/; ComponentLink2Description: Datasheet; Halogen-free: TRUE
R20 = CMP-2000-00739-1: ERJ-3GEYJ200V; Manufacturer: Panasonic; Part Number: ERJ-3GEYJ200V
R22 = CMP-2000-00390-1: ERJ3EKF2702V; Manufacturer: Panasonic; Part Number: ERJ3EKF2702V
R23 = CMP-2000-03246-1: as R10 on sheet Boost-Shield-V2; Part Number: CRCW060333K0JNEA
R25 = CMP-2000-03824-5: as R12 on sheet Boost-Shield-V2; ComponentLink2URL: http://www.vishay.com/docs/20035/dcrcwe3.pdf; ComponentLink1URL: http://www.vishay.com/; Mounting Technology: Surface Mount; ComponentLink1Description: Manufacturer URL; ComponentLink2Description: Datasheet; PackageDescription: 2-Pin Surface Mount Device, Body 1.575 x 0.85 mm; PackageReference: 0603; DatasheetVersion: 06/2012
R26 = CMP-1012-00586-3: as R13 on sheet Boost-Shield-V2; PackageReference: 0603; Max Operating Temperature: 125 degC; REACH SVHC: No SVHC; Width: 0.063 inch; Length: 0.126 inch; Height: 0.024 inch; Mount: Surface Mount; Package Quantity: 1; DatasheetVersion: Apr-15; ComponentLink1Description: Manufacturer URL; Min Operating Temperature: -55 degC; Packaging: Tape and Reel; Radiation Hardening: No; ComponentLink2URL: http://industrial.panasonic.com/cdbs/www-data/pdf/RDA0000/AOA0000C86.pdf; Case Code (Metric): 3216; Pins: 8; Case Code (Imperial): 1206; Type (Resistor): Thick Film; RoHSCompliant: true; ComponentLink2Description: Datasheet; PackageDescription: 2-Pin Surface Mount Device, Body 1.6 x 0.85 mm; ComponentLink1URL: http://www.panasonic.com/
R27 = CMP-2000-00783-1: ERJ-3GEYJ392V; Manufacturer: Panasonic; Part Number: ERJ-3GEYJ392V
R28 = RLP73V2BR011FTDF: as R7 on sheet Boost-Shield-V1
U4 = CMP-1095-00140-1: as U2 on sheet Boost-Shield-V2; PackageDescription: 4-Pin Small Outline Transistor Package, 6.5 x 3.5 mm Body, 2.3 mm Pitch; PartNumber: ITS4142N; ComponentLink2Description: Datasheet; PackageReference: SOT223; Mounting Technology: Surface Mount; PackageVersion: Apr-08; Packing: Reel; ComponentLink1Description: Manufacturer URL; Load Current (typ): 1.4Â A; ComponentLink3Description: Package Specification; ComponentLink1URL: http://www.infineon.com/; IL (nom)min - one channel active: 1.4Â A; ComponentLink3URL: http://www.infineon.com/dgdl/SOT223-Package_Overview.pdf?folderId=db3a30431936bc4b0119530470b03c3d&fileId=db3a30431936bc4b0119531d40b93c5c; ComponentLink2URL: http://www.infineon.com/dgdl/ITS4142N_20060309.pdf?folderId=db3a304412b407950112b408e8c90004&fileId=db3a304412b407950112b4296b0840e1
U5 = CMP-0063-01437-3: as U1 on sheet Boost-Shield-V1; ComponentLink1URL: http://www.ti.com/general/docs/lit/getliterature.tsp?genericPartNumber=LM3478&fileType=pdf; PinCount: 8; PartNumber: LM3478MA/NOPB; PackageDescription: SOIC Narrow, 4.9 x 3.9 x 1.45mm, 8 Lead, 1.27mm Pitch; PackageReference: D0008A; Code_IPC: SOIC127P600-8; RoHS: Y; Code_JEDEC: MS-012-AA; ComponentLink1Description: Datasheet URL

## Nets that join several sheets
3.3V: Boost-Shield-V2 (P1.6), Boost-Shield-V1.5 (P3.6)
GND: Boost-Shield-V1 (14 pins), Boost-Shield-V2 (18 pins), Boost-Shield-V1.5 (15 pins)
VBAT: Boost-Shield-V1 (5 pins), Boost-Shield-V2 (7 pins), Boost-Shield-V1.5 (5 pins)
VM: Boost-Shield-V2 (P1.8 U2.1), Boost-Shield-V1.5 (P3.8 U4.1)
VOUT: Boost-Shield-V1 (C3.1 C4.1 D1.2 R6.2), Boost-Shield-V2 (D2.C D3.A R10.2), Boost-Shield-V1.5 (D4.C D5.A R23.2)
ADC: Boost-Shield-V2 (P2.5 R9.1 R11.2), Boost-Shield-V1.5 (P4.5)
CAP: Boost-Shield-V2 (D3.C R9.2 TP2.1 U2.4), Boost-Shield-V1.5 (D5.C TP4.1 U4.4)
COMP: Boost-Shield-V1 (C6.1 C9.2 U1.2), Boost-Shield-V2 (C15.1 C16.1 U3.2), Boost-Shield-V1.5 (C19.1 C20.1 U5.2)
DRAIN: Boost-Shield-V1 (6 pins), Boost-Shield-V2 (6 pins), Boost-Shield-V1.5 (6 pins)
ENABLE: Boost-Shield-V2 (P2.1 U2.3), Boost-Shield-V1.5 (P4.1 U4.3)
FEEDBACK: Boost-Shield-V1 (R3.2 R6.1 U1.3), Boost-Shield-V2 (R10.1 R14.2 U3.3), Boost-Shield-V1.5 (R23.1 R27.2 U5.3)
FS: Boost-Shield-V1 (R2.2 U1.7), Boost-Shield-V2 (R16.2 U3.7), Boost-Shield-V1.5 (R22.2 U5.7)
SD: Boost-Shield-V2 (D6.1 P2.2 Q3.1 R19.2), Boost-Shield-V1.5 (P4.2)
SENSE: Boost-Shield-V1 (C7.1 R4.1 U1.1), Boost-Shield-V2 (C17.1 R12.1 U3.1), Boost-Shield-V1.5 (C21.1 R25.1 U5.1)
SOURCE: Boost-Shield-V1 (5 pins), Boost-Shield-V2 (5 pins), Boost-Shield-V1.5 (5 pins)
VIN: Boost-Shield-V1 (C8.1 R1.2 U1.8), Boost-Shield-V2 (C14.2 R8.1 U3.8), Boost-Shield-V1.5 (C18.2 R20.1 U5.8)